# EAGLE schematic basic-handheld-turbidimeter (EAGLE 7.3.0)
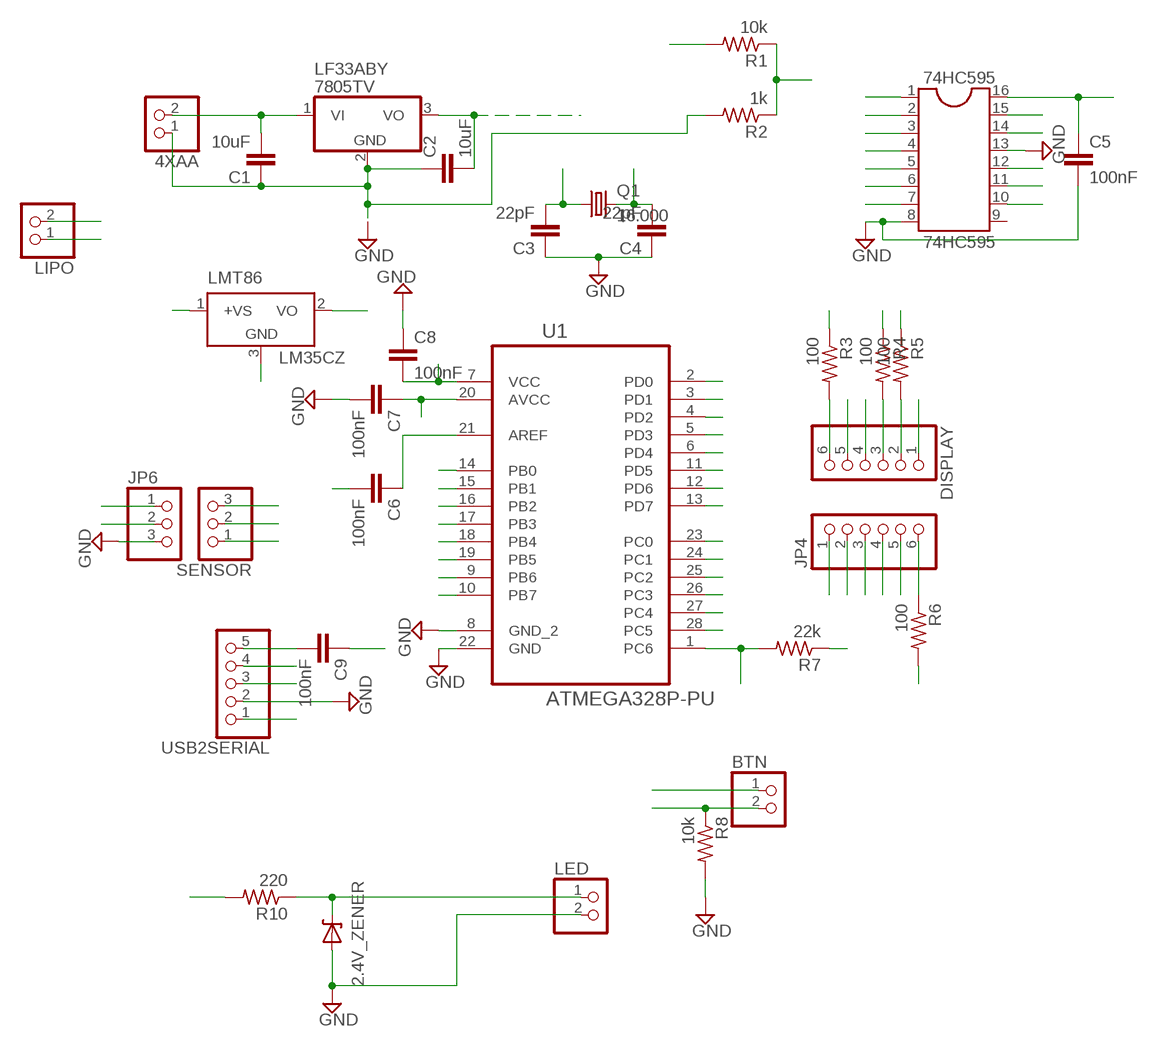
[diagram p0: schematic, sheet 1]

## Parts
2.4V_ZENER  DNP  DIODE-ZENERPTH  [DIODE-ZENER]
4XAA  PINHD-1X2  [1X02]
74HC595  74HC595  DIL16  [DIL16]
BTN  PINHD-1X2  [1X02]
C1  10uF  CAPEZ  [CAP-PTH-SMALLEZ]
C2  10uF  CAPEZ  [CAP-PTH-SMALLEZ]
C3  22pF  CAPEZ  [CAP-PTH-SMALLEZ]
C4  22pF  CAPEZ  [CAP-PTH-SMALLEZ]
C5  100nF  CAPEZ  [CAP-PTH-SMALLEZ]
C6  100nF  CAPEZ  [CAP-PTH-SMALLEZ]
C7  100nF  CAPEZ  [CAP-PTH-SMALLEZ]
C8  100nF  CAPEZ  [CAP-PTH-SMALLEZ]
C9  100nF  CAPEZ  [CAP-PTH-SMALLEZ]
DISPLAY  PINHD-1X6  [1X06]
JP4  PINHD-1X6  [1X06]
JP6  PINHD-1X3  [1X03]
LED  PINHD-1X2  [1X02]
LF33ABY  7805TV  [TO220V]
LIPO  PINHD-1X2  [1X02]
LMT86  LM35CZ  [TO92]
Q1  16.000  CRYSTALHC49S  [HC49/S]
R1  10k  R-US_0207/12  [0207/12]
R2  1k  R-US_0207/12  [0207/12]
R3  100  R-US_0207/12  [0207/12]
R4  100  R-US_0207/12  [0207/12]
R5  100  R-US_0207/12  [0207/12]
R6  100  R-US_0207/12  [0207/12]
R7  22k  R-US_0207/12  [0207/12]
R8  10k  R-US_0207/12  [0207/12]
R10  220  R-US_0207/12  [0207/12]
SENSOR  PINHD-1X3  [1X03]
U1  ATMEGA328P-PU  [DIP254P762X457-28]
USB2SERIAL  PINHD-1X5  [1X05]

## Nets
3V3: 74HC595.10 74HC595.16 BTN.1 C2.2 C5.1 C7.1 C8.2 LF33ABY.3(VO) LIPO.2 LMT86.1(+VS) R1.2 R7.1 SENSOR.1 U1.7(VCC) U1.20(AVCC) USB2SERIAL.1
595A: 74HC595.15 DISPLAY.5
595B: 74HC595.1 DISPLAY.1
595C: 74HC595.2 JP4.4
595D: 74HC595.3 JP4.2
595E: 74HC595.4 JP4.1
595F: 74HC595.5 DISPLAY.4
595G: 74HC595.6 JP4.5
595H: 74HC595.7 JP4.3
GND: 2.4V_ZENER.P$2(A) 4XAA.1 74HC595.8 74HC595.13 C1.1 C2.1 C3.1 C4.1 C5.2 C6.2 C7.2 C8.1 JP6.3 LED.2 LF33ABY.2(GND) LIPO.1 LMT86.3(GND) R2.2 R8.2 U1.5(PD3) U1.8(GND_2) U1.13(PD7) U1.22(GND) USB2SERIAL.2
LED: 2.4V_ZENER.P$1(C) LED.1 R10.1
N$1: 4XAA.2 C1.2 LF33ABY.1(VI)
N$3: C6.1 U1.21(AREF)
N$6: C9.2 USB2SERIAL.5
N$11: DISPLAY.6 R3.2
N$15: DISPLAY.3 R4.2
N$16: DISPLAY.2 R5.2
N$18: JP4.6 R6.1
PB0: 74HC595.11 U1.14(PB0)
PB1: SENSOR.3 U1.15(PB1)
PB2: R6.2 U1.16(PB2)
PB3: JP6.1 U1.17(PB3)
PB4: JP6.2 U1.18(PB4)
PB5: SENSOR.2 U1.19(PB5)
PB6: C3.2 Q1.1 U1.9(PB6)
PB7: C4.2 Q1.2 U1.10(PB7)
PC0: LMT86.2(VO) U1.23(PC0)
PC1: R5.1 U1.24(PC1)
PC2: R4.1 U1.25(PC2)
PC3: R3.1 U1.26(PC3)
PC4: R1.1 R2.1 U1.27(PC4)
PC5: U1.28(PC5)
PC6: C9.1 R7.2 U1.1(PC6)
PD0: U1.2(PD0) USB2SERIAL.3
PD1: U1.3(PD1) USB2SERIAL.4
PD2: BTN.2 R8.1 U1.4(PD2)
PD4: R10.2 U1.6(PD4)
PD5: 74HC595.14 U1.11(PD5)
PD6: 74HC595.12 U1.12(PD6)
Unconnected: 74HC595.9

## Library data of the parts
2.4V_ZENER = SparkFun-DiscreteSemi:DIODE-ZENER: Zener Diode Production Part - 8199 3.4V Zener Voltage
4XAA BTN LED LIPO = pinhead:PINHD-1X2: PIN HEADER
74HC595 = ic-package:DIL16: Dual In Line / Socket
C1-C9 = SparkFun-Capacitors:CAP: Capacitor Standard 0603 ceramic capacitor, and 0.1" leaded capacitor.
DISPLAY JP4 = pinhead:PINHD-1X6: PIN HEADER
JP6 SENSOR = pinhead:PINHD-1X3: PIN HEADER
LF33ABY = linear:78*: Positive VOLTAGE REGULATOR Source: http://cache.national.com/ds/LM/LM78L05.pdf http://www.fairchildsemi.com/ds/LM/LM7805.pdf
LMT86 = lm35:LM35: Single-Supply Centigrade Temperature Sensor Vout = (10mV/°C x Temp °C) +5mmmV Source: http://www.national.com/ds/LM/LM35.pdf
Q1 = adafruit:CRYSTAL: CRYSTAL; OC_FARNELL: 1667008; OC_NEWARK: unknown
R1-R8 R10 = rcl:R-US_: RESISTOR, American symbol
U1 = Atmel_By_element14_Batch_1-00:ATMEGA328P-PU: 8-bit Microcontroller with In-System Programmable Flash; MPN: ATMEGA328P-PU; OC_FARNELL: 1715487; OC_NEWARK: 15R0268; PACKAGE: PDIP-28; SUPPLIER: Atmel
USB2SERIAL = pinhead:PINHD-1X5: PIN HEADER